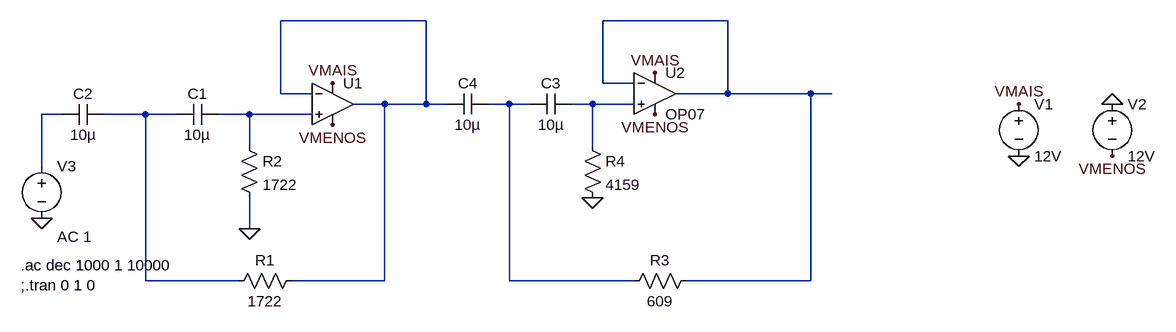
[diagram p0: schematic Circuito.asc]
Circuito.asc, the LTspice schematic file:
Version 4.1
SHEET 1 1736 680
WIRE 608 48 384 48
WIRE 1072 48 880 48
WIRE 880 144 880 48
WIRE 928 144 880 144
WIRE 384 160 384 48
WIRE 432 160 384 160
WIRE 1072 160 1072 48
WIRE 1072 160 992 160
WIRE 1200 160 1072 160
WIRE 1232 160 1200 160
WIRE 544 176 496 176
WIRE 608 176 608 48
WIRE 608 176 544 176
WIRE 640 176 608 176
WIRE 736 176 704 176
WIRE 768 176 736 176
WIRE 864 176 832 176
WIRE 928 176 864 176
WIRE 48 192 16 192
WIRE 176 192 112 192
WIRE 224 192 176 192
WIRE 336 192 288 192
WIRE 432 192 336 192
WIRE 336 240 336 192
WIRE 864 240 864 176
WIRE 16 272 16 192
WIRE 336 368 336 320
WIRE 176 448 176 192
WIRE 320 448 176 448
WIRE 544 448 544 176
WIRE 544 448 400 448
WIRE 736 448 736 176
WIRE 928 448 736 448
WIRE 1200 448 1200 160
WIRE 1200 448 1008 448
FLAG 336 368 0
FLAG 16 352 0
FLAG 864 320 0
FLAG 1520 256 0
FLAG 1664 176 0
FLAG 1520 176 VMAIS
FLAG 1664 256 VMENOS
FLAG 960 192 VMENOS
FLAG 464 208 VMENOS
FLAG 464 144 VMAIS
FLAG 960 128 VMAIS
SYMBOL cap 288 176 R90
WINDOW 0 0 32 VBottom 2
WINDOW 3 32 32 VTop 2
SYMATTR InstName C1
SYMATTR Value 10µ
SYMBOL res 320 224 R0
SYMATTR InstName R2
SYMATTR Value 1722
SYMBOL cap 112 176 R90
WINDOW 0 0 32 VBottom 2
WINDOW 3 32 32 VTop 2
SYMATTR InstName C2
SYMATTR Value 10µ
SYMBOL voltage 16 256 R0
WINDOW 123 24 124 Left 2
WINDOW 39 0 0 Left 0
SYMATTR Value2 AC 1
SYMATTR InstName V3
SYMATTR Value ""
SYMBOL OpAmps\\OP07 960 96 R0
SYMATTR InstName U2
SYMBOL cap 832 160 R90
WINDOW 0 0 32 VBottom 2
WINDOW 3 32 32 VTop 2
SYMATTR InstName C3
SYMATTR Value 10µ
SYMBOL res 848 224 R0
SYMATTR InstName R4
SYMATTR Value 4159
SYMBOL cap 704 160 R90
WINDOW 0 0 32 VBottom 2
WINDOW 3 32 32 VTop 2
SYMATTR InstName C4
SYMATTR Value 10µ
SYMBOL OpAmps\\UniversalOpAmp 464 176 R0
SYMATTR InstName U1
SYMBOL voltage 1520 160 R0
WINDOW 123 0 0 Left 0
WINDOW 39 0 0 Left 0
SYMATTR InstName V1
SYMATTR Value 12V
SYMBOL voltage 1664 160 R0
WINDOW 123 0 0 Left 0
WINDOW 39 0 0 Left 0
SYMATTR InstName V2
SYMATTR Value 12V
SYMBOL res 416 432 R90
WINDOW 0 0 56 VBottom 2
WINDOW 3 32 56 VTop 2
SYMATTR InstName R1
SYMATTR Value 1722
SYMBOL res 1024 432 R90
WINDOW 0 0 56 VBottom 2
WINDOW 3 32 56 VTop 2
SYMATTR InstName R3
SYMATTR Value 609
TEXT -16 424 Left 2 !.ac dec 1000 1 10000\n;.tran 0 1 0

The netlist it stands for:
* Circuito.asc
C1 N007 N006 10µ
R2 N007 0 1722
C2 N006 N005 10µ
V3 N005 0 AC 1
X§U2 N004 N002 VMAIS VMENOS N002 LT1001  ; OP07, pins In+ In- V+ V- OUT
C3 N004 N003 10µ
R4 N004 0 4159
C4 N003 N001 10µ
X§U1 N007 N001 VMAIS VMENOS N001 level1 Avol=1Meg GBW=10Meg Vos=0 En=0 Enk=0 In=0 Ink=0 Rin=500Meg  ; pins In+ In- V+ V- OUT
V1 VMAIS 0 12V
V2 0 VMENOS 12V
R1 N001 N006 1722
R3 N002 N003 609
.ac dec 1000 1 10000
;.tran 0 1 0
.lib LTC.lib
.lib UniversalOpAmp1.lib
.backanno
.end